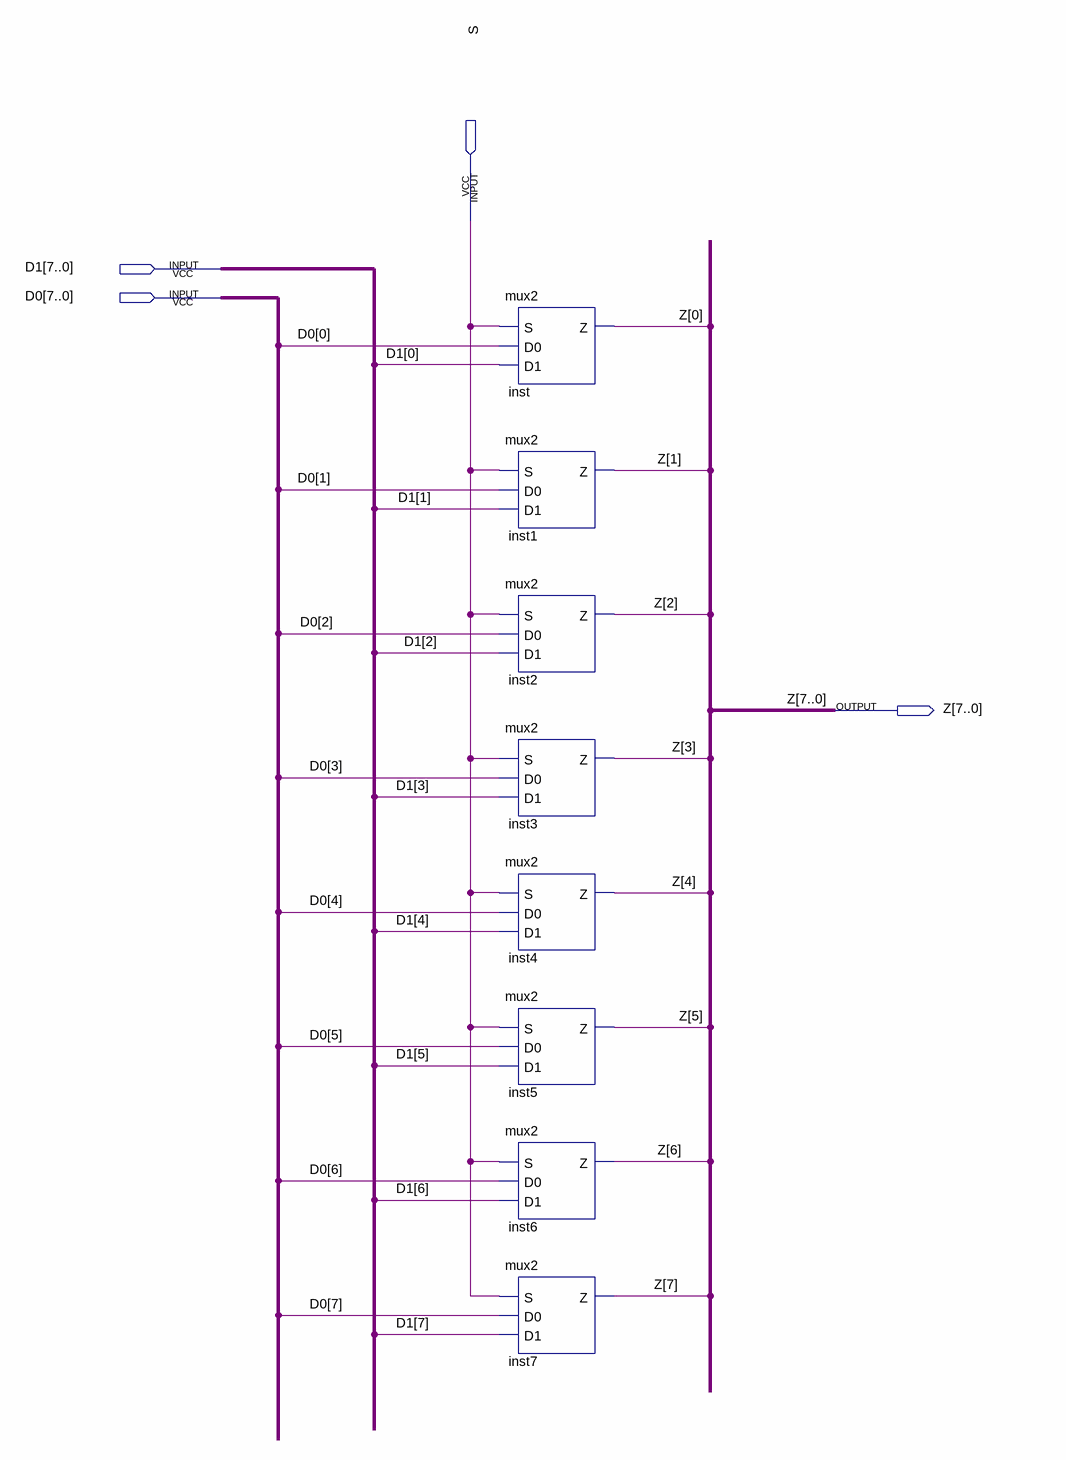
[diagram p0: schematic sheet]
// Quartus schematic mux2_8bit.bdf as structural Verilog: 8 symbols, 4 pins
module mux2_8bit (
  input  S,
  input  [7:0] D1,
  input  [7:0] D0,
  output [7:0] Z
);

  mux2 inst (.S(S), .D0(D0[0]), .D1(D1[0]), .Z(Z[0]));
  mux2 inst1 (.S(S), .D0(D0[1]), .D1(D1[1]), .Z(Z[1]));
  mux2 inst2 (.S(S), .D0(D0[2]), .D1(D1[2]), .Z(Z[2]));
  mux2 inst3 (.S(S), .D0(D0[3]), .D1(D1[3]), .Z(Z[3]));
  mux2 inst4 (.S(S), .D0(D0[4]), .D1(D1[4]), .Z(Z[4]));
  mux2 inst5 (.S(S), .D0(D0[5]), .D1(D1[5]), .Z(Z[5]));
  mux2 inst6 (.S(S), .D0(D0[6]), .D1(D1[6]), .Z(Z[6]));
  mux2 inst7 (.S(S), .D0(D0[7]), .D1(D1[7]), .Z(Z[7]));
endmodule
